# Altium schematic sheet Outputs.SchDoc: Carte Découpe DMX
size A4
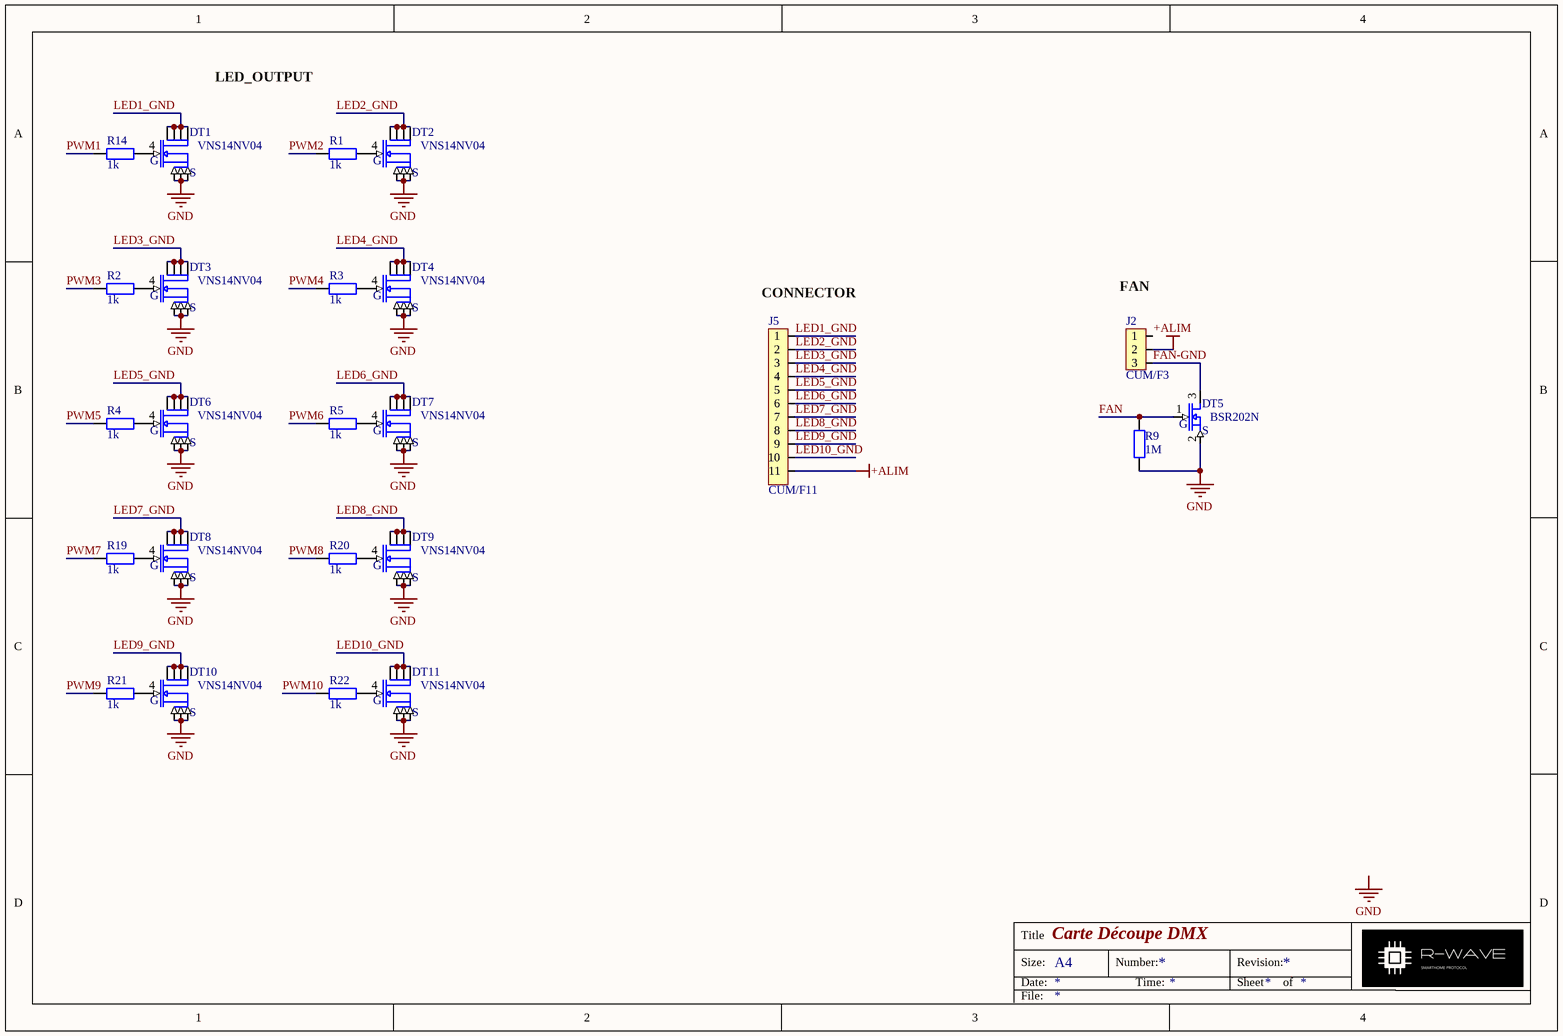
[diagram p0: Outputs.SchDoc]

## Parts
J2  CUM/F3  [HDR1X3]
J5  CUM/F11  [CNT11D]
R1  1k  [R0603]
R2  1k  [R0603]
R3  1k  [R0603]
R4  1k  [R0603]
R5  1k  [R0603]
R9  1M  [R0603]
R14  1k  [R0603]
R19  1k  [R0603]
R20  1k  [R0603]
R21  1k  [R0603]
R22  1k  [R0603]
T1  VNS14NV04  [TRA14NV04]
T2  VNS14NV04  [TRA14NV04]
T3  VNS14NV04  [TRA14NV04]
T4  VNS14NV04  [TRA14NV04]
T5  BSR202N  [TRA202]
T6  VNS14NV04  [TRA14NV04]
T7  VNS14NV04  [TRA14NV04]
T8  VNS14NV04  [TRA14NV04]
T9  VNS14NV04  [TRA14NV04]
T10  VNS14NV04  [TRA14NV04]
T11  VNS14NV04  [TRA14NV04]

## Nets
+ALIM: J2.2 J5.11
GND: R9.1 T1.1 T1.2 T1.3 T2.1 T2.2 T2.3 T3.1 T3.2 T3.3 T4.1 T4.2 T4.3 T5.2(S) T6.1 T6.2 T6.3 T7.1 T7.2 T7.3 T8.1 T8.2 T8.3 T9.1 T9.2 T9.3 T10.1 T10.2 T10.3 T11.1 T11.2 T11.3
FAN: R9.2 T5.1(G)
FAN-GND: J2.3 T5.3(D)
LED1_GND: J5.1 T1.5 T1.6 T1.7 T1.8
LED2_GND: J5.2 T2.5 T2.6 T2.7 T2.8
LED3_GND: J5.3 T3.5 T3.6 T3.7 T3.8
LED4_GND: J5.4 T4.5 T4.6 T4.7 T4.8
LED5_GND: J5.5 T6.5 T6.6 T6.7 T6.8
LED6_GND: J5.6 T7.5 T7.6 T7.7 T7.8
LED7_GND: J5.7 T8.5 T8.6 T8.7 T8.8
LED8_GND: J5.8 T9.5 T9.6 T9.7 T9.8
LED9_GND: J5.9 T10.5 T10.6 T10.7 T10.8
LED10_GND: J5.10 T11.5 T11.6 T11.7 T11.8
PWM1: R14.2
PWM2: R1.2
PWM3: R2.2
PWM4: R3.2
PWM5: R4.2
PWM6: R5.2
PWM7: R19.2
PWM8: R20.2
PWM9: R21.2
PWM10: R22.2
NetR1_1: R1.1 T2.4
NetR2_1: R2.1 T3.4
NetR3_1: R3.1 T4.4
NetR4_1: R4.1 T6.4
NetR5_1: R5.1 T7.4
NetR14_1: R14.1 T1.4
NetR19_1: R19.1 T8.4
NetR20_1: R20.1 T9.4
NetR21_1: R21.1 T10.4
NetR22_1: R22.1 T11.4

Not connected (* = marked no-connect by the designer): J2 1

## Notes on the sheet
- LED_OUTPUT
- (near J5) CONNECTOR
- (near J2) FAN
- Labels drawn without touching a wire or pin: GND
- Title
- Size:
- Date:
- A4
- Number:
- Time:
- Revision:
- Sheet
- of
- File:
- (in symbol VNS14NV04) D; G; S

## Library data of the parts
J2 = CUM/F3: connecteur 3 points
J5 = CUM/F11: connecteur 10 points
R1-R5 R9 R14 R19-R22 = Res: Thin Metal Film Resistor
  R1-R5 R14 R19-R22: Value: 1k
  R9: Value: 1M
T1-T4 T6-T11 = VNS14NV04: TRANSISTOR MOS N
T5 = BSR202N: TRANSISTOR MOS N